# Altium schematic sheet processor_breakout_conn.SchDoc
size A4; Organization: Badgerloop; Address1: 133 Engineering Research; Address2: Building; Address3: Madison, WI 53715; SheetNumber: X; SheetTotal: Y
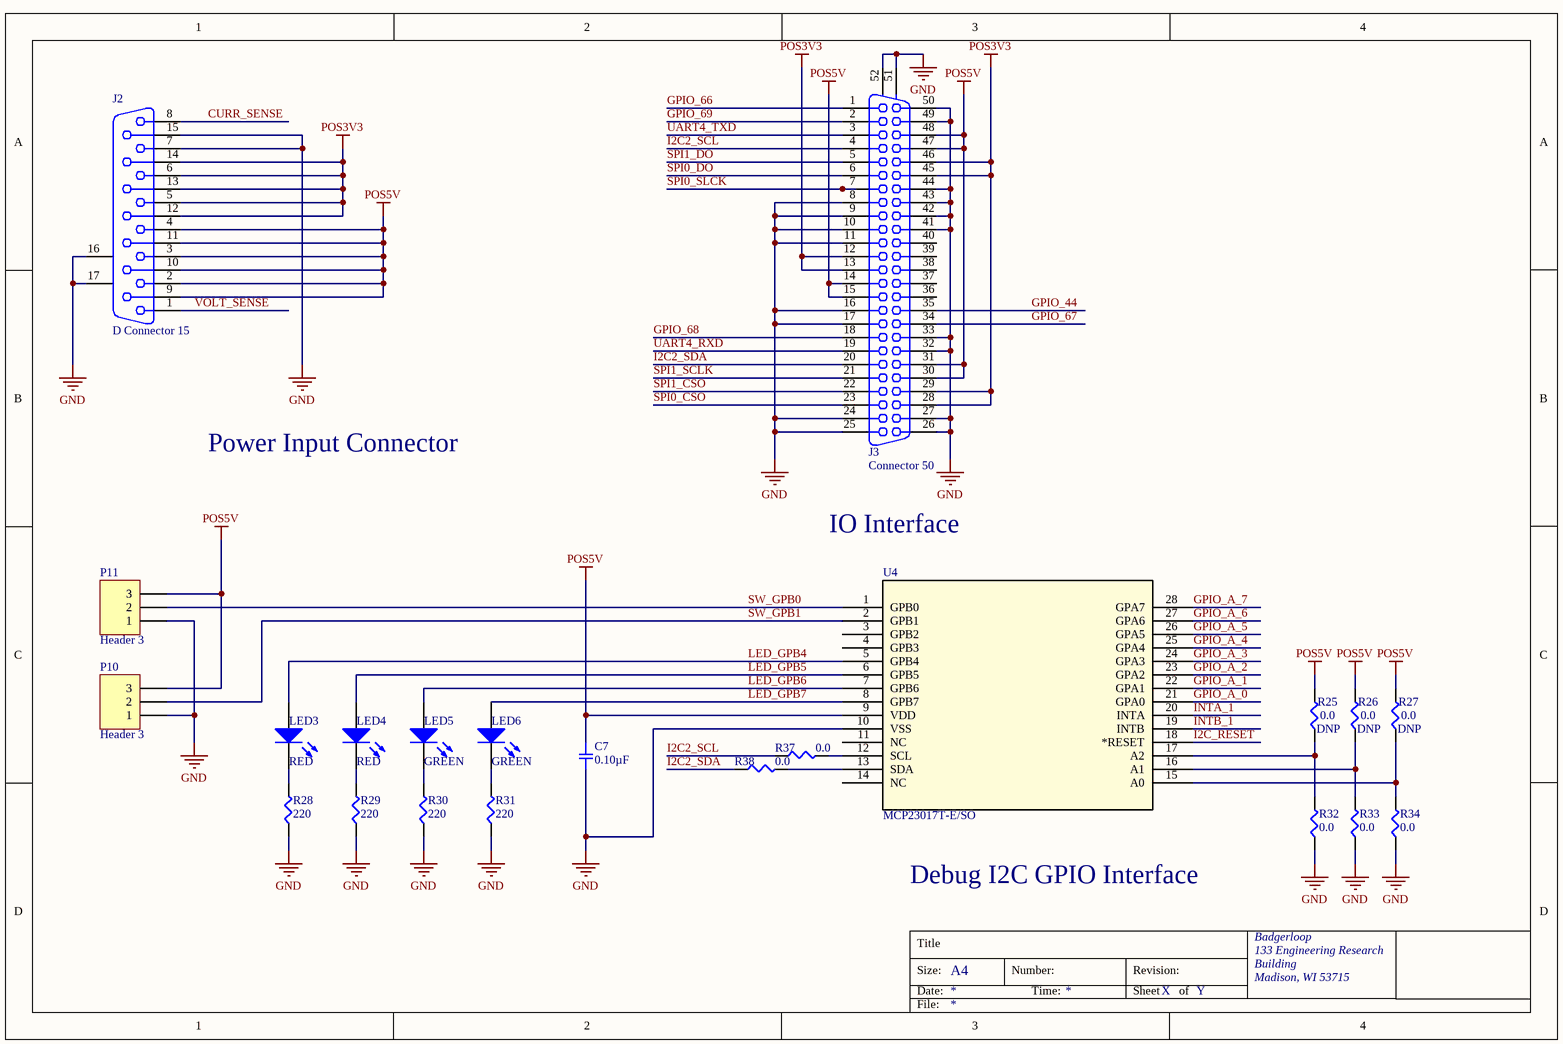
[diagram p0: processor_breakout_conn.SchDoc]

## Parts
C7  0.10µF  [SMD-0603C]
J2  D Connector 15  [DSUB1.385-2H15]
J3  Connector 50  [050DSUB1.27-H96]
LED3  RED  [LED 0603 RED]
LED4  RED  [LED 0603 RED]
LED5  GREEN  [LED 0603 GREEN]
LED6  GREEN  [LED 0603 GREEN]
P10  Header 3  [Pin Header 1x3 TH Pitch 2.54mm]
P11  Header 3  [Pin Header 1x3 TH Pitch 2.54mm]
R25  0.0  [SMD-0402-RES]
R26  0.0  [SMD-0402-RES]
R27  0.0  [SMD-0402-RES]
R28  220  [SMD-0805-RES]
R29  220  [SMD-0805-RES]
R30  220  [SMD-0805-RES]
R31  220  [SMD-0805-RES]
R32  0.0  [SMD-0402-RES]
R33  0.0  [SMD-0402-RES]
R34  0.0  [SMD-0402-RES]
R37  0.0  [SMD-0402-RES]
R38  0.0  [SMD-0402-RES]
U4  MCP23017T-E/SO  [SOIC28-W_MC-M]

## Nets
GND: C7.2 J2.7 J2.15 J2.16(MH1) J2.17(MH2) J3.8 J3.9 J3.10 J3.11 J3.16 J3.17 J3.24 J3.25 J3.26 J3.27 J3.32 J3.33 J3.41 J3.42 J3.43 J3.44 J3.49 J3.50 J3.51 J3.52 P10.1 P11.1 R28.1 R29.1 R30.1 R31.1 R32.1 R33.1 R34.1 U4.10(VSS)
POS3V3: J2.5 J2.6 J2.12 J2.13 J2.14 J3.12 J3.13 J3.28 J3.29 J3.45 J3.46
POS5V: C7.1 J2.2 J2.3 J2.4 J2.9 J2.10 J2.11 J3.14 J3.15 J3.30 J3.31 J3.47 J3.48 P10.3 P11.3 R25.2 R26.2 R27.2 U4.9(VDD)
CURR_SENSE: J2.8
GPIO_44: J3.35
GPIO_66: J3.1
GPIO_67: J3.34
GPIO_68: J3.18
GPIO_69: J3.2
GPIO_A_0: U4.21(GPA0)
GPIO_A_1: U4.22(GPA1)
GPIO_A_2: U4.23(GPA2)
GPIO_A_3: U4.24(GPA3)
GPIO_A_4: U4.25(GPA4)
GPIO_A_5: U4.26(GPA5)
GPIO_A_6: U4.27(GPA6)
GPIO_A_7: U4.28(GPA7)
I2C2_SCL: J3.4 R37.1
I2C2_SDA: J3.20 R38.1
I2C_RESET: U4.18(*RESET)
INTA_1: U4.20(INTA)
INTB_1: U4.19(INTB)
LED_GPB4: LED3.1(A) U4.5(GPB4)
LED_GPB5: LED4.1(A) U4.6(GPB5)
LED_GPB6: LED5.1(A) U4.7(GPB6)
LED_GPB7: LED6.1(A) U4.8(GPB7)
SPI0_CSO: J3.23
SPI0_DO: J3.6
SPI0_SLCK: J3.7
SPI1_CSO: J3.22
SPI1_DO: J3.5
SPI1_SCLK: J3.21
SW_GPB0: P11.2 U4.1(GPB0)
SW_GPB1: P10.2 U4.2(GPB1)
UART4_RXD: J3.19
UART4_TXD: J3.3
VOLT_SENSE: J2.1
NetLED3_2: LED3.2(K) R28.2
NetLED4_2: LED4.2(K) R29.2
NetLED5_2: LED5.2(K) R30.2
NetLED6_2: LED6.2(K) R31.2
NetR25_1: R25.1 R32.2 U4.17(A2)
NetR26_1: R26.1 R33.2 U4.16(A1)
NetR27_1: R27.1 R34.2 U4.15(A0)
NetR37_2: R37.2 U4.12(SCL)
NetR38_2: R38.2 U4.13(SDA)

Not connected (* = marked no-connect by the designer): J3 36 37 38 39 40; U4 3(GPB2) 4(GPB3) 11(NC) 14(NC)

## Notes on the sheet
- Power Input Connector
- IO Interface
- Debug I2C GPIO Interface
- Title
- Size:
- Date:
- A4
- Number:
- Time:
- Revision:
- Sheet
- of
- File:

## Library data of the parts
C7 = GCJ188R72A104KA01D: CAP CER 0.1UF 100V X7R 0603; Manufacturer: Murata Electronics North America; Factory Stock: 0; Unit Price (USD): 0.23; Minimum Quantity: 1; Tolerance: ±10%; Datasheets: http://www.murata.com/~/media/webrenewal/support/library/catalog/products/capacitor/mlcc/c03e.ashx; Image: //media.digikey.com/Renders/Murata%20Renders/0603%28LQG18%29.jpg; Digi-Key Part Number: 490-13420-1-ND; Part Number: GCJ188R72A104KA01D; Quantity Available: 2728; @ qty: 0; Packaging: Cut Tape (CT); Series: GCJ; Part Status: Active; Value: 0.10µF; Voltage: 100V; Temperature Coefficient: X7R; Operating Temperature: -55°C ~ 125°C; Features: Soft Termination; Ratings: AEC-Q200; Applications: Automotive, Boardflex Sensitive; Mounting Type: Surface Mount, MLCC; Package / Case: 0603 (1608 Metric); Size / Dimension: 0.063" L x 0.031" W (1.60mm x 0.80mm); Height - Seated (Max): -; Thickness (Max): 0.035" (0.90mm); Lead Spacing: -; Lead Style: -
J2 = D Connector 15: Receptacle Assembly, 15 Position, Right Angle; PackageDocument: O; Positions: 15; Published: 15-Jun-2001; LatestRevisionDate: 17-Jul-2002; LatestRevisionNote: Re-released for DXP Platform.; DatasheetDocument: 1-Sep-99; PackageReference: 788757; Publisher: Altium Limited; Orientation: Right Angle; Gender: Receptacle
J3 = Connector 50: Receptacle Header Assemby; PackageDocument: B; Positions: 50; Published: 15-Jun-2001; LatestRevisionDate: 17-Jul-2002; LatestRevisionNote: Re-released for DXP Platform.; DatasheetDocument: 1-Oct-1983; PackageReference: 178240-7; Publisher: Altium Limited; Orientation: Right Angle
LED3 LED4 = LED RED 0603: Red 631nm LED Indication - Discrete 2V 0603 (1608 Metric); Manufacturer: Lite-On Inc.; Manufacturer P/N: LTST-C190KRKT; Digikey P/N: 160-1436-1-ND; Package / Case: 0603; Color: RED
LED5 LED6 = LED GREEN 0603: Manufacturer: Lite-On Inc.; Manufacturer P/N: LTST-C190KGKT; Digikey P/N: 160-1435-1-ND; Package / Case: 0603; Color: GREEN
P10 P11 = Header 3: Header, 3-Pin; LatestRevisionDate: 17-Jul-2002; LatestRevisionNote: Re-released for DXP Platform.; Publisher: Altium Limited
R25-R27 R32-R34 R37 R38 = ERJ-2GE0R00X: RES SMD 0.0OHM JUMPER 1/10W 0402; Manufacturer: Panasonic Electronic Components; Factory Stock: 0; Unit Price (USD): 0.00384; @ qty: 1500; Minimum Quantity: 1; Power (Watts): 0.1W, 1/10W; Part Number: ERJ-2GE0R00X; Datasheets: http://industrial.panasonic.com/www-cgi/jvcr13pz.cgi?E+PZ+3+AOA0001+ERJ2GE0R00X+7+WW; Image: //media.digikey.com/Photos/Panasonic%20Photos/ERJ-PA2-Series.jpg; Digi-Key Part Number: P0.0JCT-ND; Quantity Available: 3152483; Packaging: Cut Tape (CT); Series: ERJ; Part Status: Active; Value: 0.0; Tolerance: Jumper; Composition: Thick Film; Features: Automotive AEC-Q200; Temperature Coefficient: -; Operating Temperature: -55°C ~ 155°C; Package / Case: 0402 (1005 Metric); Supplier Device Package: 0402; Size / Dimension: 0.039" L x 0.020" W (1.00mm x 0.50mm); Height - Seated (Max): 0.016" (0.40mm); Number of Terminations: 2; Failure Rate: -
  R25-R27: DNP: DNP
  R32-R34: DNP: *
R28-R31 = ERJ-6ENF2200V: RES SMD 220 OHM 1% 1/8W 0805; Manufacturer: Panasonic Electronic Components; Factory Stock: 0; Unit Price (USD): 0.00729; @ qty: 1500; Minimum Quantity: 1; Power (Watts): 0.125W, 1/8W; Temperature Coefficient: ±100ppm/°C; Part Number: ERJ-6ENF2200V; Datasheets: http://industrial.panasonic.com/www-cgi/jvcr13pz.cgi?E+PZ+3+AOA0002+ERJ6ENF2200V+7+WW; Image: //media.digikey.com/Renders/Panasonic%20Renders/ERJ-0805%20Pkg.jpg; Digi-Key Part Number: P220CCT-ND; Quantity Available: 111570; Packaging: Cut Tape (CT); Series: ERJ; Part Status: Active; Value: 220; Tolerance: ±1%; Composition: Thick Film; Features: Automotive AEC-Q200; Operating Temperature: -55°C ~ 155°C; Package / Case: 0805 (2012 Metric); Supplier Device Package: 0805; Size / Dimension: 0.079" L x 0.049" W (2.00mm x 1.25mm); Height - Seated (Max): 0.028" (0.70mm); Number of Terminations: 2; Failure Rate: -
U4 = MCP23017T-E/SO: Imported; Vendor: Microchip; Built_By: EMA_UL_Team; C: Copyright (C) 2015 Accelerated Designs. All rights reserved; Manufacturer_Part_Number: MCP23017T-E/SO; RefDes: RefDes; Type: DEV; Value: Value